# Altium schematic sheet iPhone11ProMaxWAII.SchDoc
size A
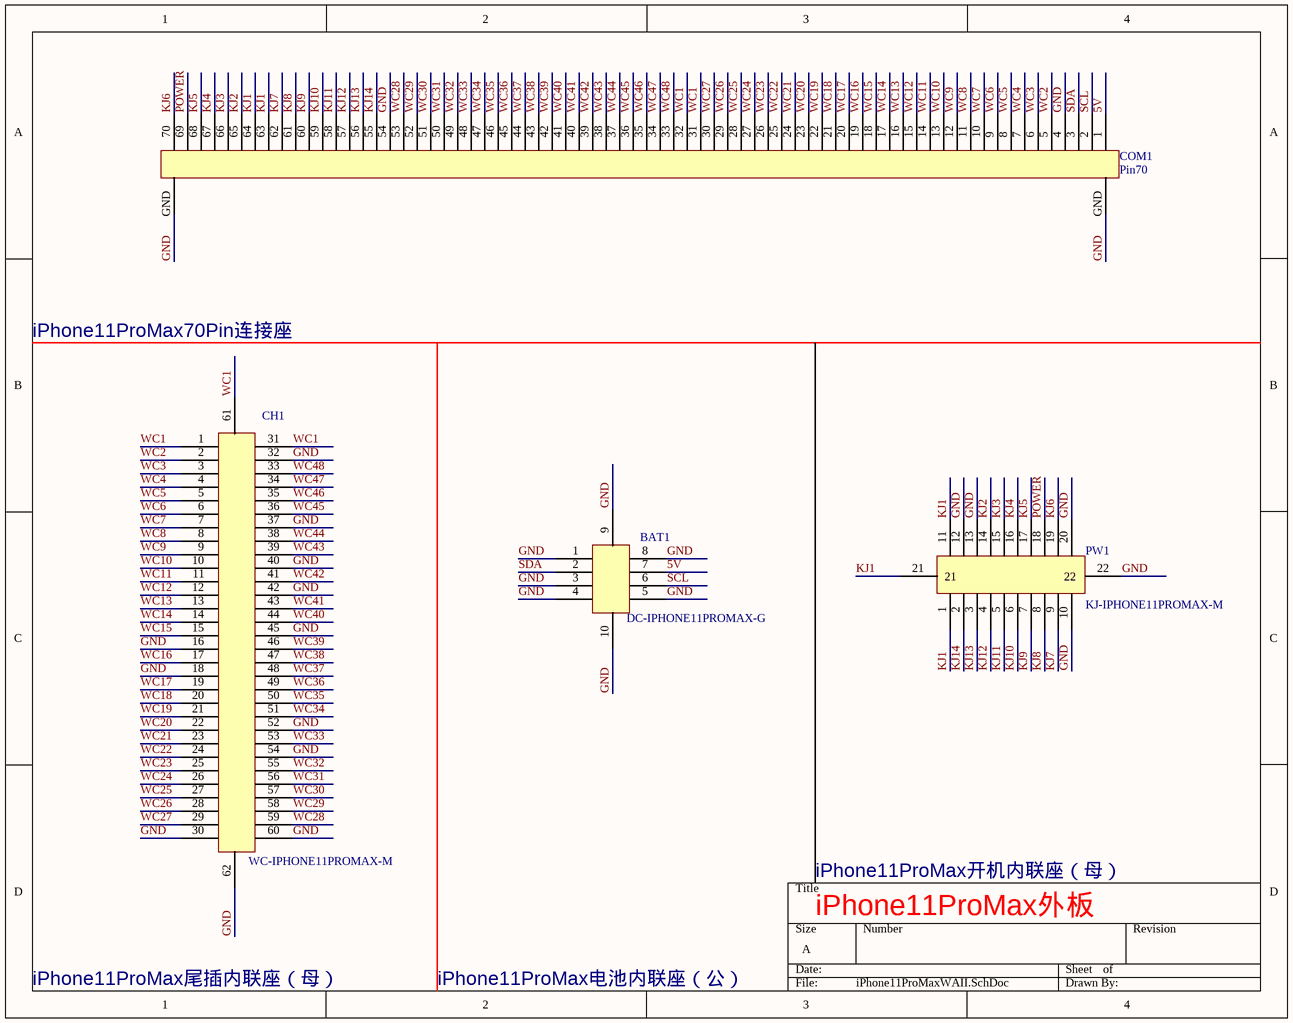
[diagram p0: iPhone11ProMaxWAII.SchDoc]

## Parts
BAT1  DC-IPHONE11PROMAX-G  [IPHONE11-WXCD-G]
CH1  WC-IPHONE11PROMAX-M  [IPHONE11PROMAX-WC-M]
COM1  Pin70  [Pin70]
PW1  KJ-IPHONE11PROMAX-M  [IPHONE11PROMAX-KJ-M]

## Nets
5V: BAT1.7 COM1.1
GND: BAT1.1 BAT1.3 BAT1.4 BAT1.5 BAT1.8 BAT1.9 BAT1.10 CH1.16 CH1.18 CH1.30 CH1.32 CH1.37 CH1.40 CH1.42 CH1.45 CH1.52 CH1.54 CH1.60 CH1.62 COM1.4 COM1.54 COM1.GND PW1.10 PW1.12 PW1.13 PW1.20 PW1.22
KJ1: COM1.63 COM1.64 PW1.1 PW1.11 PW1.21
KJ2: COM1.65 PW1.14
KJ3: COM1.66 PW1.15
KJ4: COM1.67 PW1.16
KJ5: COM1.68 PW1.17
KJ6: COM1.70 PW1.19
KJ7: COM1.62 PW1.9
KJ8: COM1.61 PW1.8
KJ9: COM1.60 PW1.7
KJ10: COM1.59 PW1.6
KJ11: COM1.58 PW1.5
KJ12: COM1.57 PW1.4
KJ13: COM1.56 PW1.3
KJ14: COM1.55 PW1.2
POWER: COM1.69 PW1.18
SCL: BAT1.6 COM1.2
SDA: BAT1.2 COM1.3
WC1: CH1.1 CH1.31 CH1.61 COM1.31 COM1.32
WC2: CH1.2 COM1.5
WC3: CH1.3 COM1.6
WC4: CH1.4 COM1.7
WC5: CH1.5 COM1.8
WC6: CH1.6 COM1.9
WC7: CH1.7 COM1.10
WC8: CH1.8 COM1.11
WC9: CH1.9 COM1.12
WC10: CH1.10 COM1.13
WC11: CH1.11 COM1.14
WC12: CH1.12 COM1.15
WC13: CH1.13 COM1.16
WC14: CH1.14 COM1.17
WC15: CH1.15 COM1.18
WC16: CH1.17 COM1.19
WC17: CH1.19 COM1.20
WC18: CH1.20 COM1.21
WC19: CH1.21 COM1.22
WC20: CH1.22 COM1.23
WC21: CH1.23 COM1.24
WC22: CH1.24 COM1.25
WC23: CH1.25 COM1.26
WC24: CH1.26 COM1.27
WC25: CH1.27 COM1.28
WC26: CH1.28 COM1.29
WC27: CH1.29 COM1.30
WC28: CH1.59 COM1.53
WC29: CH1.58 COM1.52
WC30: CH1.57 COM1.51
WC31: CH1.56 COM1.50
WC32: CH1.55 COM1.49
WC33: CH1.53 COM1.48
WC34: CH1.51 COM1.47
WC35: CH1.50 COM1.46
WC36: CH1.49 COM1.45
WC37: CH1.48 COM1.44
WC38: CH1.47 COM1.43
WC39: CH1.46 COM1.42
WC40: CH1.44 COM1.41
WC41: CH1.43 COM1.40
WC42: CH1.41 COM1.39
WC43: CH1.39 COM1.38
WC44: CH1.38 COM1.37
WC45: CH1.36 COM1.36
WC46: CH1.35 COM1.35
WC47: CH1.34 COM1.34
WC48: CH1.33 COM1.33

## Notes on the sheet
- iPhone11ProMax70Pin连接座
- iPhone11ProMax开机内联座（母）
- iPhone11ProMax外板
- iPhone11ProMax尾插内联座（母）
- iPhone11ProMax电池内联座（公）

## Library data of the parts
BAT1 = WXCD-IPHONE11-G